# Altium project ESP32_IoT Gateaway.PrjPcb (part 1 of 2)
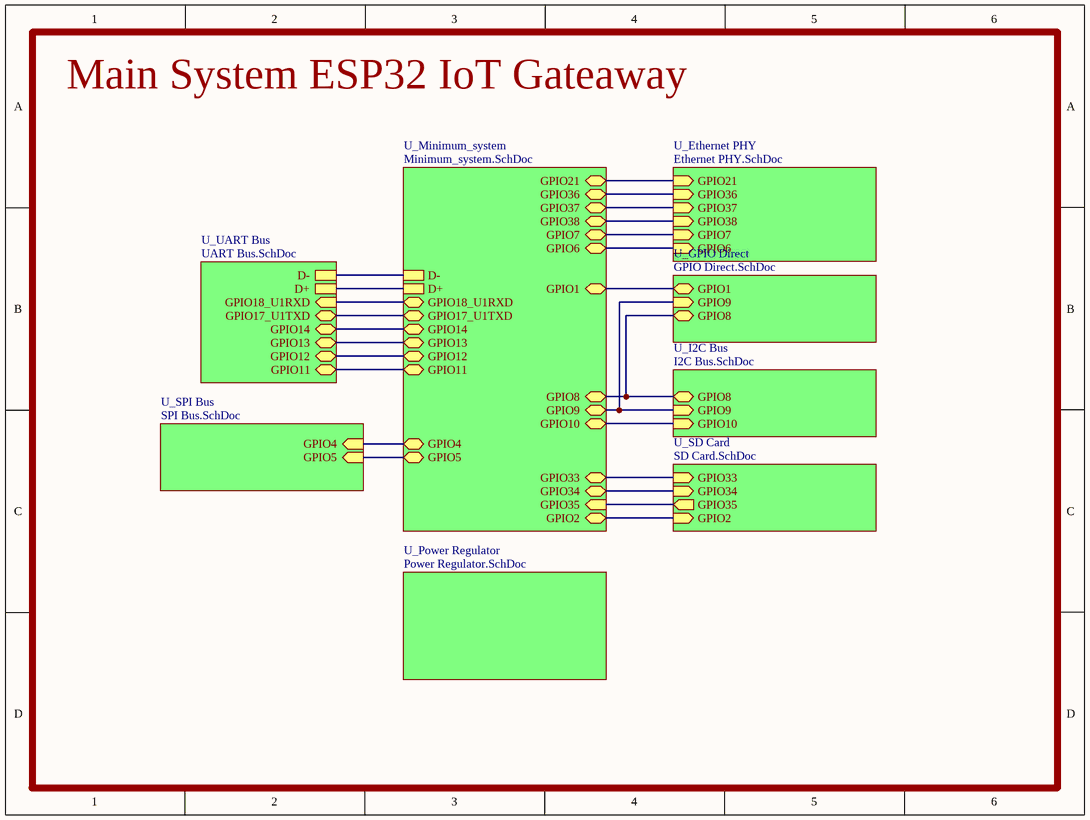
[diagram p0: Main ESP32_IoT Gateaway.SchDoc]
9 sheets, 167 parts. Net scope: hierarchical (ports join the sheet entries above them; power ports are global).
Board file: Main ESP32_IoT Gateaway.PcbDoc
Sheets:
  Main ESP32_IoT Gateaway.SchDoc
    U_UART Bus = UART Bus.SchDoc
    U_Minimum_system = Minimum_system.SchDoc
    U_SPI Bus = SPI Bus.SchDoc
    U_Ethernet PHY = Ethernet PHY.SchDoc
    U_Power Regulator = Power Regulator.SchDoc
    U_SD Card = SD Card.SchDoc
    U_I2C Bus = I2C Bus.SchDoc
    U_GPIO Direct = GPIO Direct.SchDoc

## Sheet Main ESP32_IoT Gateaway.SchDoc
size 203 x 152 mm

### Sub-sheets
U_Ethernet PHY = Ethernet PHY.SchDoc: GPIO21 (in), GPIO36 (in), GPIO37 (in), GPIO38 (in), GPIO6 (in), GPIO7 (in)
U_GPIO Direct = GPIO Direct.SchDoc: GPIO1 (bidir), GPIO9 (in), GPIO8 (bidir)
U_I2C Bus = I2C Bus.SchDoc: GPIO10 (in), GPIO9 (in), GPIO8 (bidir)
U_Minimum_system = Minimum_system.SchDoc: GPIO14 (bidir), GPIO13 (bidir), GPIO12 (bidir), GPIO11 (bidir), D-, D+, GPIO6 (bidir), GPIO7 (bidir), GPIO18_U1RXD (bidir), GPIO17_U1TXD (bidir), GPIO38 (bidir), GPIO37 (bidir), GPIO36 (bidir), GPIO21 (bidir), GPIO1 (bidir), GPIO5 (bidir), GPIO4 (bidir), GPIO2 (bidir), GPIO35 (in), GPIO34 (bidir), GPIO33 (bidir), GPIO10 (bidir), GPIO9 (bidir), GPIO8 (bidir)
U_Power Regulator = Power Regulator.SchDoc: no entries
U_SD Card = SD Card.SchDoc: GPIO33 (in), GPIO34 (in), GPIO35 (out), GPIO2 (in)
U_SPI Bus = SPI Bus.SchDoc: GPIO4 (in), GPIO5 (in)
U_UART Bus = UART Bus.SchDoc: GPIO12 (bidir), GPIO11 (bidir), GPIO13 (bidir), GPIO14 (bidir), GPIO17_U1TXD (bidir), GPIO18_U1RXD (in), D-, D+

### Nets
ADS_ALERT: sheet U_Minimum_system/GPIO10, sheet U_I2C Bus/GPIO10
CD/DATA3: sheet U_Minimum_system/GPIO2, sheet U_SD Card/GPIO2
D_N: sheet U_UART Bus/D-, sheet U_Minimum_system/D-
D_P: sheet U_UART Bus/D+, sheet U_Minimum_system/D+
I2C_SCL: sheet U_Minimum_system/GPIO9, sheet U_I2C Bus/GPIO9, sheet U_GPIO Direct/GPIO9
I2C_SDA: sheet U_Minimum_system/GPIO8, sheet U_I2C Bus/GPIO8, sheet U_GPIO Direct/GPIO8
NetESP32S3_6: sheet U_Minimum_system/GPIO1, sheet U_GPIO Direct/GPIO1
NetESP32S3_9: sheet U_Minimum_system/GPIO4, sheet U_SPI Bus/GPIO4
NetESP32S3_10: sheet U_Minimum_system/GPIO5, sheet U_SPI Bus/GPIO5
NetESP32S3_11: sheet U_Minimum_system/GPIO6, sheet U_Ethernet PHY/GPIO6
NetESP32S3_12: sheet U_Minimum_system/GPIO7, sheet U_Ethernet PHY/GPIO7
NetESP32S3_16: sheet U_UART Bus/GPIO11, sheet U_Minimum_system/GPIO11
NetESP32S3_17: sheet U_UART Bus/GPIO12, sheet U_Minimum_system/GPIO12
NetESP32S3_18: sheet U_UART Bus/GPIO13, sheet U_Minimum_system/GPIO13
NetESP32S3_19: sheet U_UART Bus/GPIO14, sheet U_Minimum_system/GPIO14
NetESP32S3_23: sheet U_UART Bus/GPIO17_U1TXD, sheet U_Minimum_system/GPIO17_U1TXD
NetESP32S3_24: sheet U_UART Bus/GPIO18_U1RXD, sheet U_Minimum_system/GPIO18_U1RXD
NetESP32S3_27: sheet U_Minimum_system/GPIO21, sheet U_Ethernet PHY/GPIO21
NetESP32S3_38: sheet U_Minimum_system/GPIO33, sheet U_SD Card/GPIO33
NetESP32S3_39: sheet U_Minimum_system/GPIO34, sheet U_SD Card/GPIO34
NetESP32S3_40: sheet U_Minimum_system/GPIO35, sheet U_SD Card/GPIO35
NetESP32S3_41: sheet U_Minimum_system/GPIO36, sheet U_Ethernet PHY/GPIO36
NetESP32S3_42: sheet U_Minimum_system/GPIO37, sheet U_Ethernet PHY/GPIO37
NetESP32S3_43: sheet U_Minimum_system/GPIO38, sheet U_Ethernet PHY/GPIO38

### Notes on the sheet
- Main System ESP32 IoT Gateaway

## Sheet UART Bus.SchDoc
size A
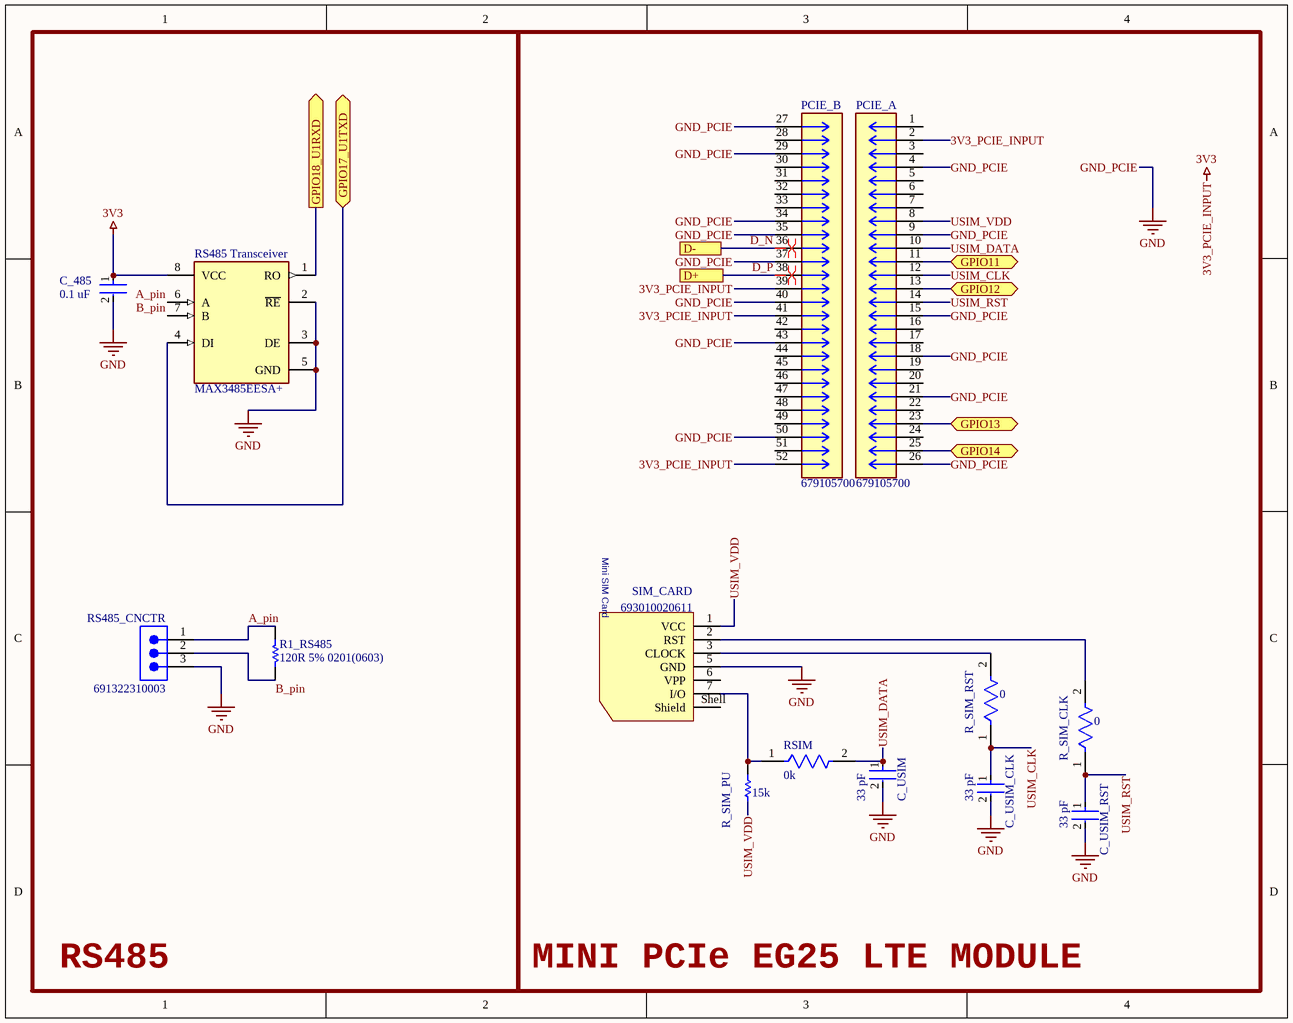
[diagram p1: UART Bus.SchDoc]

### Parts
C_485  0.1 uF  [FP-GRM155-0_05-MFG]
C_USIM  33 pF  [FP-GCM155-0_05-IPC_A]
C_USIM_CLK  33 pF  [FP-GCM155-0_05-IPC_A]
C_USIM_RST  33 pF  [FP-GCM155-0_05-IPC_A]
PCIE_  679105700  [CONN_679105700_MOL]  (parts A,B of 2)
R1_RS485  120R 5% 0201(0603)  [RESC0201(0603)_M]
R_SIM_CLK  0  [FP-CRG0402-IPC_C]
R_SIM_PU  15k  [RESC3116X65X40NL10T20]
R_SIM_RST  0  [FP-CRG0402-IPC_C]
RS485_CNCTR  691322310003  [691322310003]
RS485_Transceiver  MAX3485EESA+  [FP-S8-5-MFG]
RSIM  0k  [FP-CRG0402-IPC_C]
SIM_CARD  693010020611  [693010020611]

### Blocks framed on the sheet
RS485: C_485 R1_RS485 RS485_CNCTR RS485_Transceiver
MINI PCIe EG25 LTE MODULE: C_USIM C_USIM_CLK C_USIM_RST PCIE_ R_SIM_CLK R_SIM_PU R_SIM_RST RSIM SIM_CARD

### Ports
D+, D-, GPIO11 (bidir), GPIO12 (bidir), GPIO13 (bidir), GPIO14 (bidir), GPIO17_U1TXD (bidir), GPIO18_U1RXD (out)

### Nets
3V3: C_485.1 PCIE_.2 PCIE_.39 PCIE_.41 PCIE_.52 RS485_Transceiver.8(VCC)  [also labelled 3V3_PCIE_INPUT]
GND: C_485.2 C_USIM.2 C_USIM_CLK.2 C_USIM_RST.2 PCIE_.4 PCIE_.9 PCIE_.15 PCIE_.18 PCIE_.21 PCIE_.26 PCIE_.27 PCIE_.29 PCIE_.34 PCIE_.35 PCIE_.37 PCIE_.40 PCIE_.43 PCIE_.50 RS485_CNCTR.3 RS485_Transceiver.2(~{RE}) RS485_Transceiver.3(DE) RS485_Transceiver.5(GND) SIM_CARD.5(GND)  [also labelled GND_PCIE]
A_pin: R1_RS485.1 RS485_CNCTR.1 RS485_Transceiver.6(A)
B_pin: R1_RS485.2 RS485_CNCTR.2 RS485_Transceiver.7(B)
D_N: PCIE_.36 ; port D-
D_P: PCIE_.38 ; port D+
USIM_CLK: C_USIM_CLK.1 PCIE_.12 R_SIM_RST.1
USIM_DATA: C_USIM.1 PCIE_.10 RSIM.2
USIM_RST: C_USIM_RST.1 PCIE_.14 R_SIM_CLK.1
USIM_VDD: PCIE_.8 R_SIM_PU.2 SIM_CARD.1(VCC)
NetESP32S3_16: PCIE_.11 ; port GPIO11
NetESP32S3_17: PCIE_.13 ; port GPIO12
NetESP32S3_18: PCIE_.23 ; port GPIO13
NetESP32S3_19: PCIE_.25 ; port GPIO14
NetESP32S3_23: RS485_Transceiver.4(DI) ; port GPIO17_U1TXD
NetESP32S3_24: RS485_Transceiver.1(RO) ; port GPIO18_U1RXD
NetR_SIM_CLK_2: R_SIM_CLK.2 SIM_CARD.2(RST)
NetR_SIM_PU_1: R_SIM_PU.1 RSIM.1 SIM_CARD.7(I/O)
NetR_SIM_RST_2: R_SIM_RST.2 SIM_CARD.3(CLOCK)

Not connected (* = marked no-connect by the designer): PCIE_ 1 3 5 6 7 16 17 19 20 22 24 28 30 31 32 33 42 44 45 46 47 48 49 51; SIM_CARD 6(VPP) Shell(Shield)

### Layout directives
differential pair: D_N, D_P

### Notes on the sheet
- (in symbol CMP-1502-00155-3) Mini SIM Card

### Library data of the parts
C_485 = CMP-06035-062118-1: Chip Multilayer Ceramic Capacitors for General Purpose, 0402, 0.10uF, X7R, 15%, 20%, 50V; RoHS Compliant: Yes
C_USIM C_USIM_CLK C_USIM_RST = CMP-2008-03705-2: Ceramic Capacitor for Automotive 33pF ±5% 50VDC C0G 0402 Paper T/R; Voltage Rating: 50V; Tolerance: 5%; Packaging: Tape and Reel; Case/Package: 0402; Package Quantity: 10000; Dielectric: C0G; Voltage Rating (DC): 50V; Case Code (Imperial): 0402; Width: 0.02inch; Length: 1mm; Capacitance: 33pF; Mount: Surface Mount; Case Code (Metric): 1005; Weight: 0.000212oz; Thickness: 0.022inch; Lead Free: Lead Free; Height: 0.5mm; Max Operating Temperature: 125°C; Termination: SMD/SMT; Min Operating Temperature: -55°C; Depth: 0.5mm; Ratings: AEC-Q200
PCIE_ = CMP-018-000000-1: Pin Count: 52; Package: None; Availability: Unavailable; MP: 679105700; Value: *; Source: 679105700.SchLib; Price: None; Design Item ID: 679105700; Component Type: Standard
R1_RS485 = CMP-1010-00052-1: 120R 0.05W 5% 0201 (0603 Metric)  SMD; Case-EIA: 0201; Case-Metric: 0603; Value: 120.00 Ohm; Power: 0.05 W; Tolerance: 5 %; Technology: SMT
R_SIM_CLK R_SIM_RST RSIM = CMP-03211-011400-1: RES SMD 0 OHM JUMPER 1/16W 0402; Number of Resistors: 1; Tolerance: 0%; Voltage Rating: 50V; Insulation Resistance: 1GR; Power Rating: 63mW; Temperature Coefficient: 200ppm/°C; Resistance: 0mR; Weight: 2.3E-05oz; Number of Terminations: 2; Technology: THICK FILM; Resistor Type: Thick Film; Mount: Surface Mount; Termination: Solder; Number of Pins: 2; RoHS Compliant: Yes; Packaging: Tape and Reel; Depth: 0.5mm; Case Code (Metric): 1005; Min Operating Temperature: -55°C; Series: CRG; Height: 0.35mm; Voltage Rating (DC): 50V; Case Code (Imperial): 0402; Max Operating Temperature: 125°C; ELV: Compliant; Case/Package: 0402; Length: 1mm; Radiation Hardening: No; Width: 0.5mm; Package Quantity: 10000
R_SIM_PU = CMP-2003-03512-1: Manufacturer: Yageo; Part Number: RC1206FR-1015KL
RS485_CNCTR = CMP-1502-01887-3: 322; 3.81mm Pitch Straight Pluggable Term Block; PCB Header; Through Hole; 3 Way; Voltage: 300V; Current: 10A; Gender: Male; Number of Contacts: 3; Number of Levels: 1; Lead Pitch: 3.81mm; Termination: Solder; Packaging: Box; Length: 10.5mm; Contact Plating: Tin; RoHS: Compliant; Number of Rows: 1; Contact Material: Tin; Height: 7.2mm; Color: Green; Number of Pins: 3; Max Operating Temperature: 105°C; Current Rating: 10A; Voltage Rating: 300V; Min Operating Temperature: -40°C; Pitch: 3.81mm; Mount: Through Hole; Number of Positions Per Level: 3; Width: 12.82mm
RS485_Transceiver = CMP-05679-000038-1: IC TXRX RS485/422 10MBPS 8SOIC; Manufacturer: Maxim Integrated; Number Of Receivers: 1; Simplex Duplex: Half Duplex; Data Rate: 15Mbits/s; Interface: RS-485,RS-422; Max Supply Voltage: 3.6V; Nominal Supply Current: 0.95-1.1mA; Min Supply Voltage: 3V; Standoff Height: 0.1mm; Mouser Description: RS-422/RS-485 Interface IC 3.3V 12Mbps Transceiver; Lead Free: Yes; Footprint Url: https://pdfserv.maximintegrated.com/land_patterns/90-0096.PDF; Device Class L1: Integrated Circuits (ICs); Device Class L3: RS-232 / RS-422 / RS-485 Interface ICs; RoHS: TRUE; Height: 1.75mm; ComponentLink2URL: https://datasheets.maximintegrated.com/en/ds/MAX3483E-MAX3491E.pdf; Temperature Range High: +85°C; Temperature: -40°C to +85°C; Manufacturer Part Number: MAX3485EESA+; Number Of Transmitters: 1; Device Class L2: Interface ICs; Octopart: https://octopart.com/max3485eesa%2B-maxim+integrated-39731903; ComponentLink2Description: Datasheet; Category: IC; Digikey Description: IC TXRX RS485/422 10MBPS 8SOIC; Automotive: No; Temperature Range Low: -40°C; Package: S8-5
SIM_CARD = CMP-1502-00155-3: WR-CRD Mini SIM Card Connector Header Shielded; Current Rating: 500mA; Operating Supply Voltage: 50V; Insulation Resistance: 500MΩ; Connector Type: Connector, Socket; Number of Positions: 6; Mount: Surface Mount; Max Operating Temperature: 85°C; Length: 16.4mm; Height: 1.8mm; REACH SVHC: Unknown; Number of Contacts: 6; Min Operating Temperature: -25°C; Number of Pins: 6; Contact Material: Copper; Width: 16.3mm; Contact Plating: Gold; Packaging: Tape and Reel; RoHS: Compliant

## Sheet Minimum_system.SchDoc
size 431 x 279 mm; ENG_APP_DATE: --/--/--; DSN_APP_DATE: --/--/--; CHK_APP_DATE: --/--/--
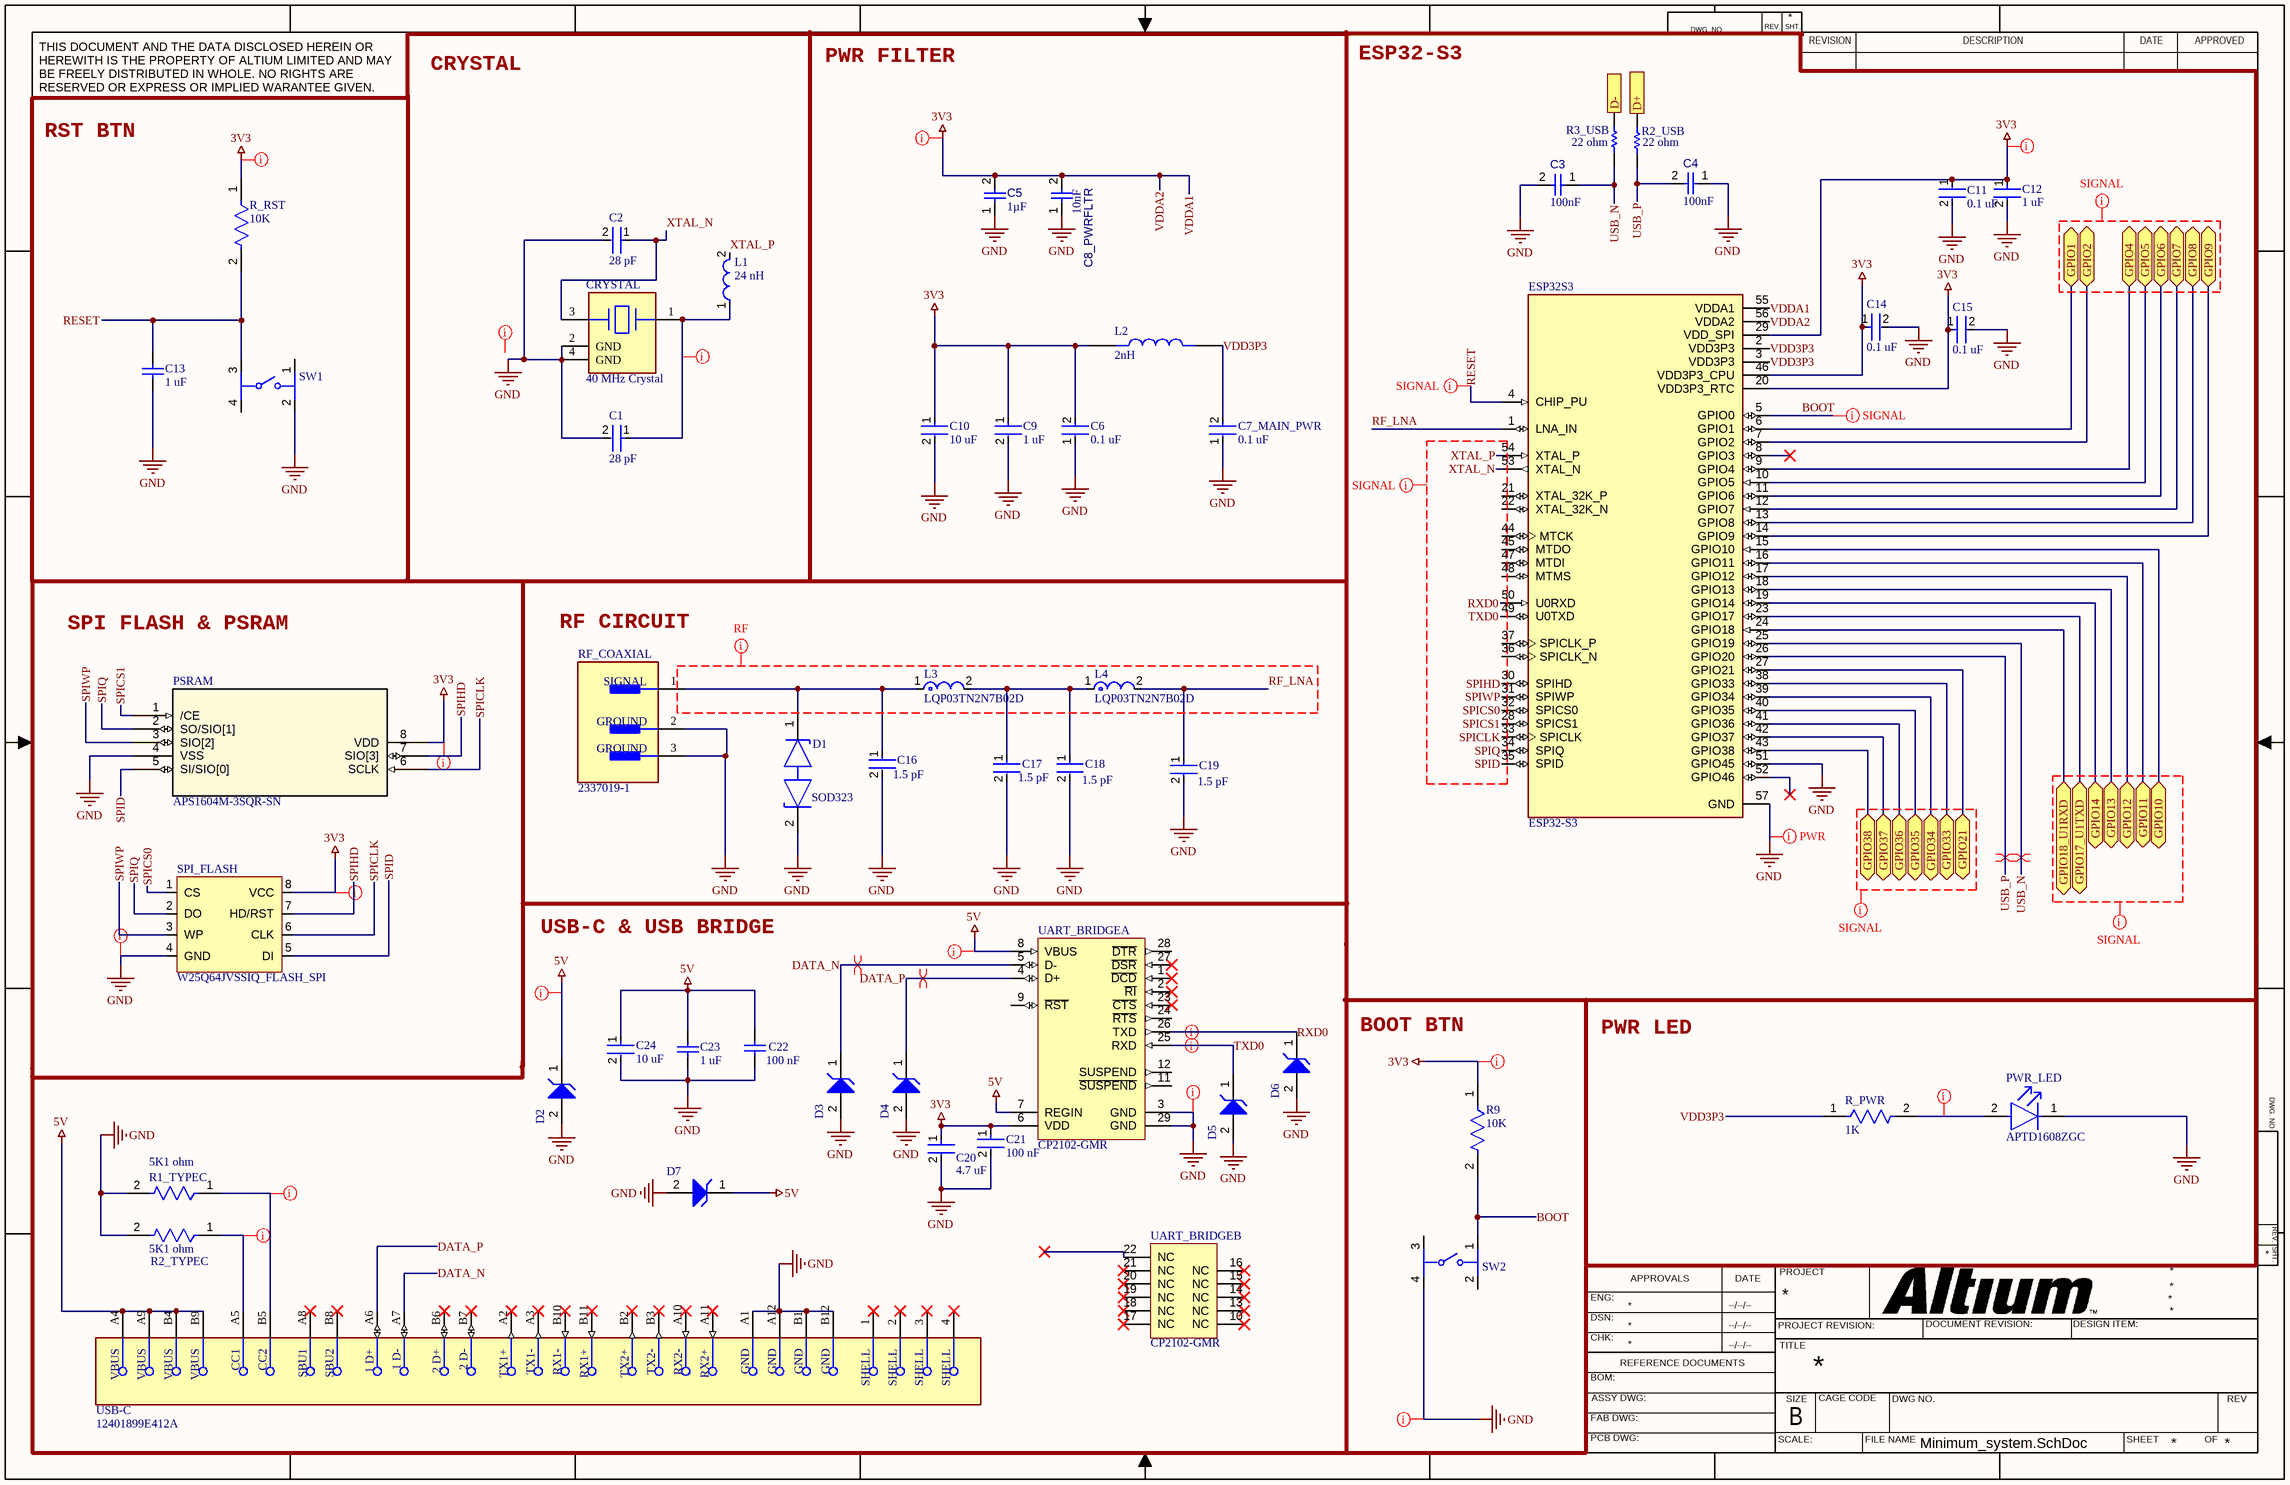
[diagram p2: Minimum_system.SchDoc]

### Parts
C1  28 pF  [FP-GQM219-0_15-MFG]
C2  28 pF  [FP-GQM219-0_15-MFG]
C3  value 100nF  [CAPC0402(1005)60_L]  (hidden comment: Capacitor 100nF +/-20% 50V 0402)
C4  value 100nF  [CAPC0402(1005)60_L]  (hidden comment: Capacitor 100nF +/-20% 50V 0402)
C5  value 1µF  [CAPC1608X90X35ML15T15]  (hidden comment: Capacitor 1uF +/- 10% 16V 0603)
C6  0.1 uF  [FP-C1608-080-0_1-IPC_B]
C7_MAIN_PWR  0.1 uF  [FP-C1608-080-0_1-IPC_B]
C8_PWRFLTR  value 10nF  [CAPC0402(1005)60_L]  (hidden comment: Capacitor 10nF +/-20% 50V 0402)
C9  1 uF  [FP-GRM21B-0_2-e0_2_0_7-MFG]
C10  10 uF  [FP-GRM188-0_15-IPC_C]
C11  0.1 uF  [FP-C1608-080-0_1-IPC_B]
C12  1 uF  [FP-GRM21B-0_2-e0_2_0_7-MFG]
C13  1 uF  [CAPC2013X140X50NL20T25]
C14  0.1 uF  [FP-CC0201-BA-MFG]
C15  0.1 uF  [FP-CC0201-BA-MFG]
C16  1.5 pF  [FP-GRM033-0_03-MFG]
C17  1.5 pF  [FP-GRM033-0_03-MFG]
C18  1.5 pF  [FP-GRM033-0_03-MFG]
C19  1.5 pF  [FP-GRM033-0_03-MFG]
C20  4.7 uF  [FP-GCJ31C-0_3-IPC_C]
C21  100 nF  [FP-GRM155-0_05-MFG]
C22  100 nF  [CAPC0603X33X15NL03T05]
C23  1 uF  [CAPC2013X140X50NL20T25]
C24  10 uF  [FP-GRM188-0_15-IPC_C]
CRYSTAL  40 MHz Crystal  [FP-ABM8AIG-MFG]
D1  SOD323  [FP-SOD323-CA-MFG]
D2  824520581  [WE-TVSP_DO-214AA_Unidirectional]  (value not drawn)
D3  824520581  [WE-TVSP_DO-214AA_Unidirectional]  (value not drawn)
D4  824520581  [WE-TVSP_DO-214AA_Unidirectional]  (value not drawn)
D5  824520581  [WE-TVSP_DO-214AA_Unidirectional]  (value not drawn)
D6  824520581  [WE-TVSP_DO-214AA_Unidirectional]  (value not drawn)
D7  824520581  [WE-TVSP_DO-214AA_Unidirectional]  (value not drawn)
ESP32S3  ESP32-S3  [IC_ESP32-S3]
L1  24 nH  [FP-LQW15AN_00-W0_5-0_1-MFG]
L2  value 2nH  [INDC0603X28N]  (hidden comment: ATFC-0201HQ-2N0B-T)
L3  LQP03TN2N7B02D  [FP-LQP03TG_02-IPC_A]
L4  LQP03TN2N7B02D  [FP-LQP03TG_02-IPC_A]
PSRAM  APS1604M-3SQR-SN  [SOP8L_APS1604M-3SQR-SN_APY]
PWR_LED  APTD1608ZGC  [FP-APTD1608ZGC-MFG]
R1_TYPEC  5K1 ohm  [FP-CRCW1206-e3-IPC_B]
R2_TYPEC  5K1 ohm  [FP-CRCW1206-e3-IPC_B]
R2_USB  22 ohm  [RESC1608X55X25LL10T15]
R3_USB  22 ohm  [RESC1608X55X25LL10T15]
R9  10K  [FP-AC0603-IPC_A]
R_PWR  1K  [FP-RP732B-MFG]
R_RST  10K  [FP-AC0603-IPC_A]
RF_COAXIAL  2337019-1  [FP-2337019-1-MFG]
SPI_FLASH  W25Q64JVSSIQ_FLASH_SPI  [SOIC127P790X216-8N]
SW1  PTS810SJM250SMTRLFS  [FP-PTS810SJM250SMTRLFS-MFG]  (value not drawn)
SW2  PTS810SJM250SMTRLFS  [FP-PTS810SJM250SMTRLFS-MFG]  (value not drawn)
UART_BRIDGE  CP2102-GMR  [SLAB-QFN-28-3125x3125TP_M]  (parts A,B of 2)
USB-C  12401899E412A  [FP-12401899E412A-MFG]

### Ports
D+, D-, GPIO1 (bidir), GPIO2 (bidir), GPIO4 (bidir), GPIO5 (bidir), GPIO6 (bidir), GPIO7 (bidir), GPIO8 (bidir), GPIO9 (bidir), GPIO10 (bidir), GPIO11 (bidir), GPIO12 (bidir), GPIO13 (bidir), GPIO14 (bidir), GPIO17_U1TXD (bidir), GPIO18_U1RXD (bidir), GPIO21 (bidir), GPIO33 (bidir), GPIO34 (bidir), GPIO35 (bidir), GPIO36 (bidir), GPIO37 (bidir), GPIO38 (bidir)

### Nets
3V3: C5.2 C6.2 C8_PWRFLTR.2 C9.1 C10.1 C11.1 C12.1 C14.1 C15.1 C20.1 C21.1 ESP32S3.20(VDD3P3_RTC) ESP32S3.29(VDD_SPI) ESP32S3.46(VDD3P3_CPU) ESP32S3.55(VDDA1) ESP32S3.56(VDDA2) L2.1 PSRAM.8(VDD) R9.1 R_RST.1 SPI_FLASH.8(VCC) UART_BRIDGE.6(VDD)  [also labelled VDDA1, VDDA2]
5V: C22.2 C23.1 C24.1 D2.1(K) D7.1(K) UART_BRIDGE.7(REGIN) UART_BRIDGE.8(VBUS) USB-C.A4(VBUS) USB-C.A9(VBUS) USB-C.B4(VBUS) USB-C.B9(VBUS)
GND: C1.2 C2.2 C3.2 C4.1 C5.1 C6.1 C7_MAIN_PWR.1 C8_PWRFLTR.1 C9.2 C10.2 C11.2 C12.2 C13.2 C14.2 C15.2 C16.2 C17.2 C18.2 C19.2 C20.2 C21.2 C22.1 C23.2 C24.2 CRYSTAL.2(GND) CRYSTAL.4(GND) D1.2(K2) D2.2(A) D3.2(A) D4.2(A) D5.2(A) D6.2(A) D7.2(A) ESP32S3.51(GPIO45) ESP32S3.57(GND) PSRAM.4(VSS) PWR_LED.1(C) R1_TYPEC.2 R2_TYPEC.2 RF_COAXIAL.2(GROUND) RF_COAXIAL.3(GROUND) SPI_FLASH.4(GND) SW1.2 SW2.4 UART_BRIDGE.3(GND) UART_BRIDGE.29(GND) USB-C.A1(GND) USB-C.A12(GND) USB-C.B1(GND) USB-C.B12(GND)
ADS_ALERT: ESP32S3.15(GPIO10) ; port GPIO10
BOOT: ESP32S3.5(GPIO0) R9.2 SW2.1
CD/DATA3: ESP32S3.7(GPIO2) ; port GPIO2
D_N: R3_USB.1 ; port D-
D_P: R2_USB.1 ; port D+
DATA_N: D3.1(K) UART_BRIDGE.5(D-) USB-C.A7(1_D-)
DATA_P: D4.1(K) UART_BRIDGE.4(D+) USB-C.A6(1_D+)
I2C_SCL: ESP32S3.14(GPIO9) ; port GPIO9
I2C_SDA: ESP32S3.13(GPIO8) ; port GPIO8
RESET: C13.1 ESP32S3.4(CHIP_PU) R_RST.2 SW1.3
RF_LNA: C19.1 ESP32S3.1(LNA_IN) L4.2
RXD0: D6.1(K) ESP32S3.50(U0RXD) UART_BRIDGE.26(TXD)
SPICLK: ESP32S3.33(SPICLK) PSRAM.6(SCLK) SPI_FLASH.6(CLK)
SPICS0: ESP32S3.32(SPICS0) SPI_FLASH.1(CS)
SPICS1: ESP32S3.28(SPICS1) PSRAM.1(/CE)
SPID: ESP32S3.35(SPID) PSRAM.5(SI/SIO[0]) SPI_FLASH.5(DI)
SPIHD: ESP32S3.30(SPIHD) PSRAM.7(SIO[3]) SPI_FLASH.7(HD/RST)
SPIQ: ESP32S3.34(SPIQ) PSRAM.2(SO/SIO[1]) SPI_FLASH.2(DO)
SPIWP: ESP32S3.31(SPIWP) PSRAM.3(SIO[2]) SPI_FLASH.3(WP)
TXD0: D5.1(K) ESP32S3.49(U0TXD) UART_BRIDGE.25(RXD)
USB_N: C3.1 ESP32S3.25(GPIO19) R3_USB.2
USB_P: C4.2 ESP32S3.26(GPIO20) R2_USB.2
VDD3P3: C7_MAIN_PWR.2 ESP32S3.2(VDD3P3) ESP32S3.3(VDD3P3) L2.2 R_PWR.1
XTAL_N: C2.1 CRYSTAL.3 ESP32S3.53(XTAL_N)
XTAL_P: ESP32S3.54(XTAL_P) L1.2
NetC1_1: C1.1 CRYSTAL.1 L1.1
NetC16_1: C16.1 D1.1(K1) L3.1 RF_COAXIAL.1(SIGNAL)
NetC17_1: C17.1 C18.1 L3.2 L4.1
NetESP32S3_6: ESP32S3.6(GPIO1) ; port GPIO1
NetESP32S3_9: ESP32S3.9(GPIO4) ; port GPIO4
NetESP32S3_10: ESP32S3.10(GPIO5) ; port GPIO5
NetESP32S3_11: ESP32S3.11(GPIO6) ; port GPIO6
NetESP32S3_12: ESP32S3.12(GPIO7) ; port GPIO7
NetESP32S3_16: ESP32S3.16(GPIO11) ; port GPIO11
NetESP32S3_17: ESP32S3.17(GPIO12) ; port GPIO12
NetESP32S3_18: ESP32S3.18(GPIO13) ; port GPIO13
NetESP32S3_19: ESP32S3.19(GPIO14) ; port GPIO14
NetESP32S3_23: ESP32S3.23(GPIO17) ; port GPIO17_U1TXD
NetESP32S3_24: ESP32S3.24(GPIO18) ; port GPIO18_U1RXD
NetESP32S3_27: ESP32S3.27(GPIO21) ; port GPIO21
NetESP32S3_38: ESP32S3.38(GPIO33) ; port GPIO33
NetESP32S3_39: ESP32S3.39(GPIO34) ; port GPIO34
NetESP32S3_40: ESP32S3.40(GPIO35) ; port GPIO35
NetESP32S3_41: ESP32S3.41(GPIO36) ; port GPIO36
NetESP32S3_42: ESP32S3.42(GPIO37) ; port GPIO37
NetESP32S3_43: ESP32S3.43(GPIO38) ; port GPIO38
NetPWR_LED_2: PWR_LED.2(A) R_PWR.2
NetR1_TYPEC_1: R1_TYPEC.1 USB-C.B5(CC2)
NetR2_TYPEC_1: R2_TYPEC.1 USB-C.A5(CC1)

Not connected (* = marked no-connect by the designer): ESP32S3 8(GPIO3)* 21(XTAL_32K_P) 22(XTAL_32K_N) 36(SPICLK_N) 37(SPICLK_P) 44(MTCK) 45(MTDO) 47(MTDI) 48(MTMS) 52(GPIO46)*; SW1 1 4; SW2 2 3; UART_BRIDGE 1(~{DCD})* 2(~{RI})* 9(~{RST}) 10(NC)* 11(~{SUSPEND}) 12(SUSPEND) 13(NC)* 14(NC)* 15(NC)* 16(NC)* 17(NC)* 18(NC)* 19(NC)* 20(NC)* 21(NC)* 22(NC)* 23(~{CTS})* 24(~{RTS}) 27(~{DSR})* 28(~{DTR}); USB-C 1(SHELL)* 2(SHELL)* 3(SHELL)* 4(SHELL)* A2(TX1+)* A3(TX1-)* A8(SBU1)* A10(RX2-)* A11(RX2+)* B2(TX2+)* B3(TX2-)* B6(2_D+)* B7(2_D-)* B8(SBU2)* B10(RX1-)* B11(RX1+)*

### Layout directives
differential pair: DATA_N, DATA_P, USB_N, USB_P
net class SIGNAL: (no net found under the mark), BOOT, RXD0, SPICLK, SPICS0, SPICS1, SPID, SPIHD, SPIQ, SPIWP, TXD0, XTAL_N, XTAL_P
net class POWER: 3V3, 5V, (no net found under the mark), GND, NetC1_1, NetPWR_LED_2, NetR1_TYPEC_1, NetR2_TYPEC_1
mark named SIGNAL: RESET
net class RF: RF_LNA

### Notes on the sheet
- CRYSTAL
- PWR FILTER
- ESP32-S3
- RST BTN
- SPI FLASH & PSRAM
- RF CIRCUIT
- USB-C & USB BRIDGE
- BOOT BTN
- PWR LED
- Labels drawn without touching a wire or pin: \
- DWG. NO.
- REV.
- SHT.
- THIS DOCUMENT AND THE DATA DISCLOSED HEREIN OR HEREWITH IS THE PROPERTY OF ALTIUM LIMITED AND MAY BE FREELY DISTRIBUTED IN WHOLE. NO RIGHTS ARE RESERVED OR EXPRESS OR IMPLIED WARANTEE GIVEN.
- REVISION
- DESCRIPTION
- DATE
- APPROVED
- ENG:
- APPROVALS
- PROJECT
- DSN:
- CHK:
- REFERENCE DOCUMENTS
- PROJECT REVISION:
- TITLE
- DOCUMENT REVISION:
- DESIGN ITEM:
- BOM:
- FAB DWG:
- PCB DWG:
- ASSY DWG:
- SCALE:
- SIZE
- B
- CAGE CODE
- FILE NAME
- DWG NO.
- SHEET
- OF
- REV

### Library data of the parts
C1 C2 = CMP-06035-024923-1: Ceramic Capacitor 28pF ±2% 250VDC C0G 0805 Paper T/R
C3 C4 = CMP-001-00067-3: Chip Capacitor, 100nF +/-20%, 50V, 0402, Thickness 0.6 mm; Tolerance: 10%; Min Operating Temperature: -55°C; Pins: 2; Case/Package: 0402; Max Operating Temperature: 85°C; Voltage Rating: 50V; Mounting Technology: SMT
C5 = CMP-001-00004-6: Chip Capacitor, 1 uF, +/- 10%, 16 V, 0603 (1608 Metric); Capacitor Type: Ceramic; Mounting Technology: SM; RoHS Compliant: True; Min Operating Temperature: -55°C; Case/Package: 0603; Pins: 2; Voltage Rating: 16V; Max Operating Temperature: 125°C; Tolerance: 10%
C6 C7_MAIN_PWR C11 = CMP-2000-04982-2: Multilayer Ceramic Capacitors 100nF ±10% 50V X7R SMD 0603; REACH SVHC: No SVHC; Voltage: 50V; Min Operating Temperature: -55°C; Package Quantity: 1; Case Code (Metric): 1608; Series: C; Termination: SMD/SMT; Length: 1.6mm; Voltage Rating: 50V; Case Code (Imperial): 0603; Number of Pins: 2; RoHS Compliant: Yes; Thickness: 0.037inch; Resistor Type: Ceramic; Radiation Hardening: No; Weight: 7.1E-05oz; Mount: Surface Mount; Capacitance: 100nF; Voltage Rating (DC): 50V; Construction: Flat; Tolerance: 10%; Lead Free: Lead Free; Case/Package: 0603; Max Operating Temperature: 125°C; Height: 0.8mm; Depth: 0.8mm; Packaging: Tape and Reel; Width: 0.031inch; Dielectric Material: Ceramic; Dielectric: X7R
C8_PWRFLTR = CMP-001-00069-3: Chip Capacitor, 10nF +/-20%, 50V, 0402, Thickness 0.6 mm; Tolerance: 5%; Max Operating Temperature: 85°C; Pins: 2; Case/Package: 0402; Voltage Rating: 50V; Min Operating Temperature: -55°C; Mounting Technology: SMT
C9 C12 = CMP-06035-022504-1: Chip Multilayer Ceramic Capacitors for General Purpose, 0805, 1.0uF, X7S, 22%, 10%, 100V; Capacitance: 1uF; Width: 1.25mm; Dielectric: X7S; Length: 2mm; Thickness: 1.25mm; Voltage Rating (DC): 100V; Tolerance: 10%
C10 C24 = CMP-06035-033844-1: Chip Multilayer Ceramic Capacitors for General Purpose, 0603, 10uF, X5R, 15%, 20%, 10V; Dielectric: X5R; Thickness: 800um; Tolerance: 20%; Length: 1.6mm; Voltage Rating (DC): 10V; Width: 800um; Capacitance: 10uF
C13 C23 = CMP-2007-04663-1: Part Number: 0805YD105MAT2A; Manufacturer: AVX Interconnect / Elco
C14 C15 = CMP-03422-000955-1: CC0201 100 nF X5R 20.00% 10 V; Manufacturer: Yageo; Manufacturer Part Number: CC0201MRX5R6BB104; Tolerance: 0.2; Temperature Coefficient: 15%; Capacitance: 100 nF; Voltage Rating: 10 V; Value: 100 nF; Material: Ceramic; Height: 0.33mm; ComponentLink2Description: Datasheet; Device Class L3: Ceramic Capacitors; Lead Free: Yes; Temperature Range Low: -55°C; Temperature Range High: +85°C; Mouser Description: Cap Ceramic 0.1uF 10V X5R 20% SMD 0201 85°C Paper T/R; Automotive: No; Temperature Characteristic: X5R; RoHS: TRUE; Octopart: https://octopart.com/cc0201mrx5r6bb104-yageo-82228190; Ipc Land Pattern Name: CAPC6030X30; ComponentLink2URL: http://www.yageo.com/documents/recent/UPY-GPHC_X5R_4V-to-50V_25.pdf; Temperature: -55°C to +85°C; Category: Cap; Package: CC0201-BA; Device Class L2: Capacitors; Footprint Url: http://www.yageo.com/exep/pages/download/literatures/UPY-C_GEN_24.pdf; Device Class L1: Passive Components
C16-C19 = CMP-2010-01517-2: Chip Multilayer Ceramic Capacitors for General Purpose, 0201, 1.5pF, C0G, 30ppm/°C, 0.1pF, 50V; Case Code (Imperial): 0201; Width: 0.012inch; Case Code (Metric): 0603; Length: 0.024inch; Termination: SMD/SMT; Mount: Surface Mount; Min Operating Temperature: -55°C; Case/Package: 0201; Package Quantity: 15000; Thickness: 0.013inch; Packaging: Tape and Reel; Capacitance: 1.5pF; Max Operating Temperature: 125°C; Voltage Rating: 50V; Voltage Rating (DC): 50V
C20 = CMP-06035-027821-1: Cap Ceramic 4.7uF 16V X7R 10% Pad SMD 1206 Soft Termination  +125°C Automotive T/R
C21 = CMP-06035-062118-1: as C_485 on sheet UART Bus; RoHS Compliant: Yes
C22 = CMP-1033-00660-2: Part Number: 02016D104KAT4A; Manufacturer: AVX Interconnect / Elco
CRYSTAL = CMP-27762-015630-1: Crystal 40MHz ±20ppm (Tol) ±100ppm (Stability) 12pF FUND 35Ω Automotive 4-Pin Ultra Mini-CSMD T/R; ESR (Equivalent Series Resistance): 35R; Packaging: Tape and Reel; Height: 0.031inch; Min Operating Temperature: -40°C; Length: 0.126inch; Width: 0.098inch; Frequency: 40MHz; Series: ABM8AIG; Ratings: AEC-Q200; RoHS Compliant: Yes; Frequency Stability: 100ppm; Max Operating Temperature: 125°C; Case/Package: SMD/SMT; Load Capacitance: 12pF; Frequency Tolerance: 20ppm; Mount: Surface Mount
D1 = CMP-14432-000001-1: TVS DIODE 5V 14V SOD323
D2-D7 = CMP-03913-71101600-2: TVS diode [Würth Elektronik] 824520581 TVS diode; Power Line Protection: No; Max Breakdown Voltage: 67.8V; Peak Pulse Power: 600W; Peak Pulse Current: 6.5A; Leakage Current: 1µA; Number of Unidirectional Channels: 1; Clamping Voltage: 93.6V; Polarity: Unidirectional; Reverse Standoff Voltage: 58V; Packaging: Cut Tape; Composition: Zener; Mount: Surface Mount; REACH SVHC: Unknown; RoHS: Compliant; Height: 2.4mm; Length: 4.32mm; Max Operating Temperature: 150°C; Min Operating Temperature: -65°C; Number of Pins: 2; Width: 3.62mm; Min Breakdown Voltage: 67.8V
ESP32S3 = CMP-031-00006-2: IC RF TxRx + MCU Bluetooth, WiFi 802.11b/g/n, Bluetooth v5.0 2.412GHz ~ 2.484GHz 56-VFQFN Exposed Pad; MF: Espressif Systems; Purchase-URL: https://pricing.snapeda.com/search/part/ESP32-S3/?ref=eda; Value: *; SnapEDA_Link: https://www.snapeda.com/parts/ESP32-S3/Espressif+Systems/view-part/?ref=snap; Component Type: Standard; Case/Package: None; Design Item ID: ESP32-S3; Availability: In Stock; Pins: 57; MP: ESP32-S3; Source: ESP32-S3.SchLib; Check_prices: https://www.snapeda.com/parts/ESP32-S3/Espressif+Systems/view-part/?ref=eda; Price: None
L1 = CMP-06042-007532-1: Wire Wound RF Inductor 24nH ±2% 280mA 0.52Ω 0402 (1005); Q Factor: 25; Core Material: Air; Test Frequency: 100MHz; Current: 270mA; Self Resonant Frequency: 3.5GHz; Shielding: Unshielded; DC Resistance (DCR): 520mR; Height: 0.5mm; Lead Free: Lead Free; Max DC Current: 280mA; Width: 0.02inch; Number of Pins: 2; Inductance Tolerance: 2%; Military Standard: Not; REACH SVHC: No SVHC; Case Code (Imperial): 0402; Inductance: 24nH; Case/Package: 0402; Current Rating: 280mA; Min Operating Temperature: -55°C; Case Code (Metric): 1005; Length: 1mm; Mount: Surface Mount; DC Current: 280mA; Weight: 2.8E-05oz; Package Quantity: 10000; Termination: SMD/SMT; Packaging: Tape and Reel; Max Operating Temperature: 125°C; Depth: 0.6mm; Tolerance: 2%
L2 = CMP-006-00023-1: MF: {'manufacturer': u'Abracon LLC'}; MP: ATFC-0201HQ-2N0B-T; Design Item ID: ATFC-0201HQ-2N0B-T; Availability: Unavailable; Component Type: Standard; Case/Package: None; Price: None; Source: ATFC-0201HQ-2N0B-T.SchLib; Pins: 2
L3 L4 = CMP-06042-013213-1: Film type RF Inductor 2.7nH ±0.1nH 500mA 0.2Ω 0201 (0603); Core Material: Non-Magnetic; Tolerance: 3%; Self Resonant Frequency: 6GHz; Current: 350mA; Test Frequency: 500MHz; Q Factor: 14; DC Resistance (DCR): 200mR; Shielding: Unshielded; DC Current: 500mA; Resistor Type: Thin Film; Case/Package: 0201; Max DC Current: 500mA; Length: 0.024inch; Case Code (Imperial): 0201; Min Operating Temperature: -55°C; Width: 0.3mm; Termination: SMD/SMT; Inductance: 2.7nH; REACH SVHC: No SVHC; Max Operating Temperature: 125°C; Height: 0.3mm; Height - Seated (Max): 0.013inch; Military Standard: Not; Packaging: Tape and Reel; Radiation Hardening: No; Lead Free: Lead Free; Package Quantity: 15000; Case Code (Metric): 0603; Current Rating: 500mA; Mount: Surface Mount; Depth: 0.33mm
PSRAM = CMP-014-000000-2: 2 MB PSRAM SPI; Manufacturer_Name: AP Memory; Pin Count: 8; RefDes: RefDes; Type: Type; Manufacturer_Part_Number: APS1604M-3SQR-SN; Copyright: Copyright (C) 2026 Ultra Librarian. All rights reserved.; Source: APS1604M-3SQR-SN.SchLib; Design Item ID: APS1604M-3SQR-SN; Component Type: Standard
PWR_LED = CMP-44529-000047-1: LED GREEN CLEAR CHIP SMD; Forward Current: 20mA; Viewing Angle: 60°; Dominant Wavelength: 525nm; Luminous Intensity: 780mcd; Forward Voltage: 3.3V; Lens Style: Clear; Max Operating Temperature: 85°C; Case/Package: 0603; Illumination Color: Green; Mount: Surface Mount; Case Code (Imperial): 0603; Case Code (Metric): 1608; Min Operating Temperature: -40°C; Length: 1.6mm; Color: Green; Lead Free: Lead Free; Width: 0.8mm; Package Quantity: 2000; Height: 0.95mm; Packaging: Tape and Reel; Test Current: 20mA
R1_TYPEC R2_TYPEC = CMP-1014-00091-2: RES Thick Film, 5.1kΩ, 5%, 0.25W, 200ppm/°C, 1206; Max Power Dissipation: 250mW; Resistance: 5.1kR; Packaging: Tape and Reel; Length: 0.126inch; Case/Package: 1206; Lead Free: Lead Free; Tolerance: 5%; Composition: Thick Film; Min Operating Temperature: -55°C; Height: 0.024inch; Temperature Coefficient: 200ppm/°C; Features: Automotive AEC-Q200; Width: 0.063inch; Number of Terminations: 2; Max Operating Temperature: 155°C; Package Quantity: 20000
R2_USB R3_USB = CMP-2000-04180-1: Manufacturer: Yageo; Part Number: RC0603FR-1022RL
R9 R_RST = CMP-03412-040683-1: RES 10kΩ 5.00% 0.2W 0603
R_PWR = CMP-03211-010976-1: Res Thin Film 1206 1.0KΩ 0.1% 0.25W 15ppm/°C Molded SMD; Manufacturer: TE Connectivity; Manufacturer Part Number: RP73D2B1K0BTDF; Voltage Rating: 200V; Lead Free: Yes; RoHS: TRUE; Category: Res; Tolerance: 0.1%; Octopart: https://octopart.com/rp73d2b1k0btdf-te+connectivity-22741139; packaging: 1000 Reel; Device Class L2: Resistors; Power Rating: 0.25W; Value: 1.0KΩ; Device Class L1: Passive Components; Device Class L3: Chip SMD Resistors; Temperature Range Low: -55°C; Package: RP732B; Series: RP73; Height: 0.65mm; Composition: Thin Film; Temperature Range High: 155°C; Automotive: No; Temperature Coefficient: 15ppm/°C; octopart_url: https://octopart.com/rp73d2b1k0btdf-te+connectivity-22741139; Temperature: -55°C to 155°C; Ipc Land Pattern Name: RESC305155X55; ComponentLink2Description: Datasheet; Resistance: 1.0KΩ; ComponentLink2URL: https://www.te.com/commerce/DocumentDelivery/DDEController?Action=showdoc&DocId=Data+Sheet%7F1773272%7FL%7Fpdf%7FEnglish%7FENG_DS_1773272_L.pdf%7F8-1879255-6
RF_COAXIAL = CMP-03357-000011-1: UMCC MICRO-COAX RECEPTACLE, GEN
SPI_FLASH = CMP-012-000000-2: 8 MB flash SPI; Component Type: Standard; Pin Count: 8; Design Item ID: Component_1; Source: W25Q64JVSSIQ.SchLib
SW1 SW2 = CMP-10040-000001-2: SWITCH TACTILE SPST-NO 0.05A 16V; Throw Configuration: SPST; Operating Force: 160gf; Actuator Type: Standard; Switch Travel: 0.15mm; Switch Function: Off-Mom; Max Current Rating: 50mA; Mechanical Life: 150000Cycles; Illumination Type: Non-Illuminated; Package Quantity: 2900; Depth: 4.6mm; Mount: Surface Mount; Packaging: Tape and Reel; Length: 3.2mm; RoHS Compliant: Yes; Case/Package: SMD/SMT; Voltage Rating (DC): 16V; Min Operating Temperature: -40°C; Termination: J-Bend; Lead Free: Lead Free; Contact Plating: Silver; Orientation: Straight; Max Operating Temperature: 85°C; Current Rating: 50mA; Color: Black
UART_BRIDGE = CMP-2000-04924-1: Single-Chip USB to URAT Bridge, 3.3 V, -40 to 85 degC, 28-Pin QFN, RoHS, Tape and Reel; Manufacturer: Silicon Labs; Interface Circuit Standard 1: RS-232; Transmitter and Receiver FIFO Counter: No; Supply Current: 26mA; Operating Supply Voltage (Min): 3V; Operating Supply Voltage (Typ): 3.3V; Data Rate: 1000kbps; Operating Supply Voltage (Max): 3.6V; Number of Channels: 1; Package URL: http://www.silabs.com/Support%20Documents/TechnicalDocs/C8051T61x.pdf; Operating Temperature (Max): 85C; Datasheet URL: http://www.mouser.com/ds/2/368/CP2102-9-247052.pdf; Operating Temperature Classification: Industrial; Operating Temperature (Min): -40C; Package Description: 28-Pin Quad-Flat No-Leads Package, Body 5 x 5 mm, Pitch 0.5 mm; Manufacturer URL: http://www.silabs.com/; Rad Hardened: No; Package Reference: QFN-28; Pin Count: 28; Packaging: TapeandReel; Mounting: SurfaceMount; Package Type: QFNEP; Datasheet Version: Rev. 1.6, 12/2013
USB-C = CMP-02355-000006-1: USB TYPE C, RECEPTACLE, TOP MOUN

## Sheet SPI Bus.SchDoc
size 149 x 100 mm
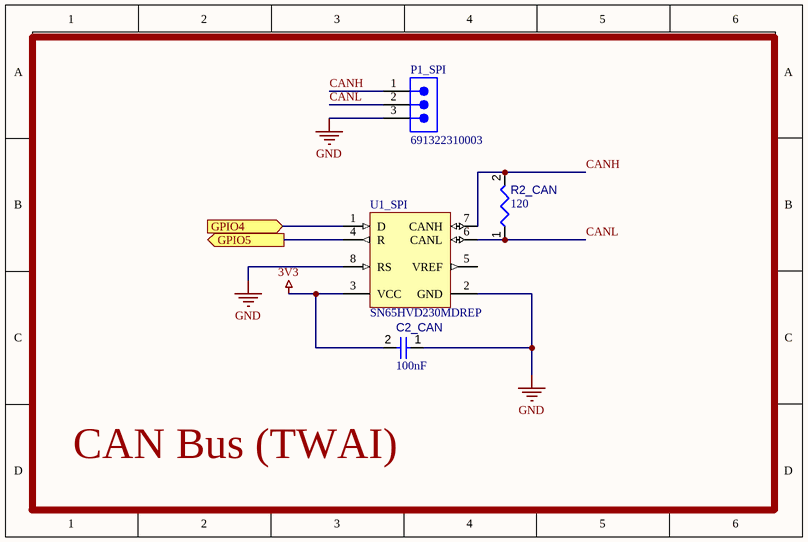
[diagram p3: SPI Bus.SchDoc]

### Parts
C2_CAN  value 100nF  [CAPC0402(1005)60_L]  (hidden comment: Capacitor 100nF +/-20% 50V 0402)
P1_SPI  691322310003  [691322310003]
R2_CAN  value 120  [RESC0603(1608)_L]  (hidden comment: Resistor 120R +/-5 % 0603 0.1 W)
U1_SPI  SN65HVD230MDREP  [D0008A_L]

### Ports
GPIO4 (in), GPIO5 (out)

### Nets
3V3: C2_CAN.2 U1_SPI.3(VCC)
GND: C2_CAN.1 P1_SPI.3 U1_SPI.2(GND) U1_SPI.8(RS)
CANH: P1_SPI.1 R2_CAN.2 U1_SPI.7(CANH)
CANL: P1_SPI.2 R2_CAN.1 U1_SPI.6(CANL)
NetESP32S3_9: U1_SPI.1(D) ; port GPIO4
NetESP32S3_10: U1_SPI.4(R) ; port GPIO5

Not connected (* = marked no-connect by the designer): U1_SPI 5(VREF)

### Notes on the sheet
- CAN Bus (TWAI)

### Library data of the parts
C2_CAN = CMP-001-00067-3: as C3 on sheet Minimum_system; Min Operating Temperature: -55°C; Pins: 2; Case/Package: 0402; Max Operating Temperature: 85°C; Voltage Rating: 50V; Mounting Technology: SMT
P1_SPI = CMP-1502-01887-3: as RS485_CNCTR on sheet UART Bus; Lead Pitch: 3.81mm; Termination: Solder; Packaging: Box; Length: 10.5mm; Contact Plating: Tin; RoHS: Compliant; Number of Rows: 1; Contact Material: Tin; Height: 7.2mm; Color: Green; Number of Pins: 3; Max Operating Temperature: 105°C; Current Rating: 10A; Voltage Rating: 300V; Min Operating Temperature: -40°C; Pitch: 3.81mm; Mount: Through Hole; Number of Positions Per Level: 3; Width: 12.82mm
R2_CAN = CMP-009-00176-3: Chip Resistor, 120 Ohms, +/-5 %, 0.1 W, -55 to 155 degC, 0603; Power: 100mW; Tolerance: 5%; Max Operating Temperature: 155°C; Pins: 2; Case/Package: 0603; Min Operating Temperature: -55°C
U1_SPI = CMP-0315-00052-2: Enhanced Product 3.3 V Can Transceiver with Standby Mode, 17 mA, -55 to 125 degC, 8-pin SOIC (D), Green (RoHS & no Sb/Br); Manufacturer: Texas Instruments; Supply Voltage(s)(V): 3.3; ICC(Max)(mA): 17; Receivers Per Package: 1; Transient Pulse Protection(V): -25 to 25; Rating: HiRel Enhanced Product; DatasheetVersion: SGLS356; Isolated: No; PackageDescription: 8-Pin Plastic Small Outline Integrated Circuit, 4.9 x 3.9 mm, Pitch 1.27 mm Pitch; Mounting Technology: Surface Mount; ComponentLink1Description: Datasheet; Low Power Mode: Standby; PackageVersion: revM, Jun-2011; SubFamily: CAN; ComponentLink1URL: http://www.ti.com/general/docs/lit/getliterature.tsp?genericPartNumber=SN65HVD230M-EP&fileType=pdf; Code_JEDEC: MS-012AA; Drivers Per Package: 1; Footprint: PCA82C250; PackageReference: D0008A; PartNumber: SN65HVD230MDREP; Eco-Plan: Green (RoHS & no Sb/Br)

## Sheet Ethernet PHY.SchDoc
size 317 x 190 mm
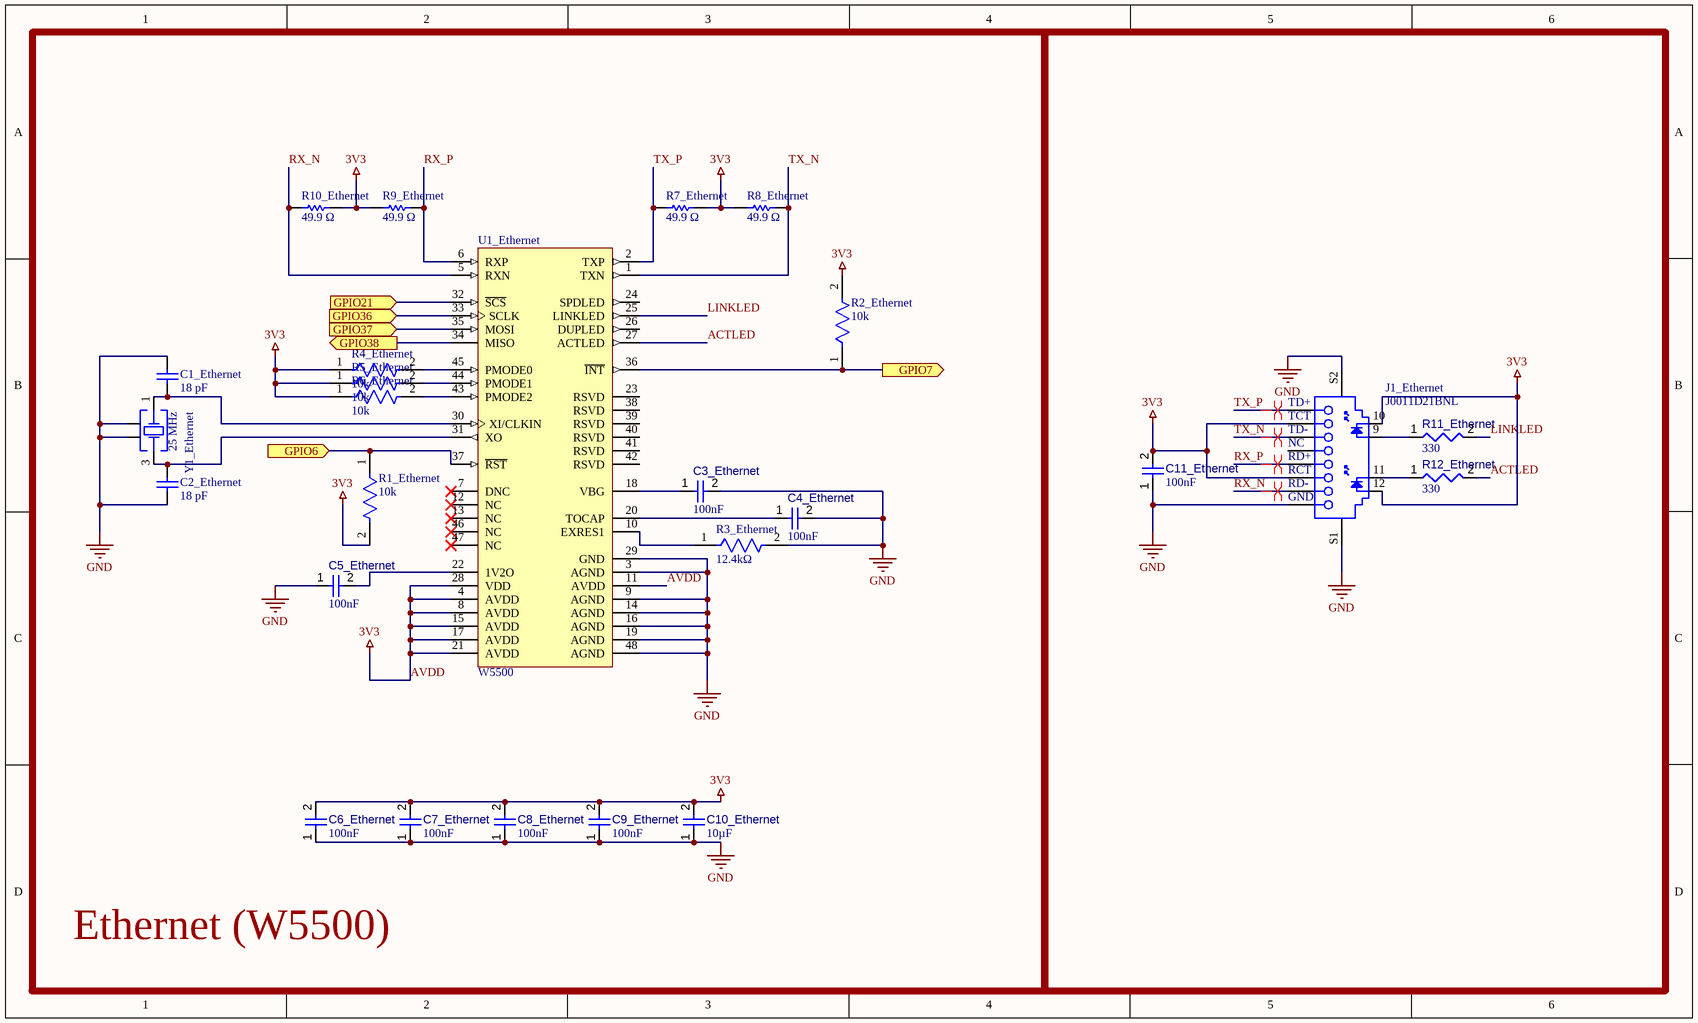
[diagram p4: Ethernet PHY.SchDoc]

### Parts
C1_Ethernet  18 pF  [CAPC1608X90X35LL10T15]
C2_Ethernet  18 pF  [CAPC1608X90X35LL10T15]
C3_Ethernet  value 100nF  [CAPC0402(1005)60_L]  (hidden comment: Capacitor 100nF +/-20% 10V 0402)
C4_Ethernet  value 100nF  [CAPC0402(1005)60_L]  (hidden comment: Capacitor 100nF +/-20% 10V 0402)
C5_Ethernet  value 100nF  [CAPC0402(1005)60_L]  (hidden comment: Capacitor 100nF +/-20% 10V 0402)
C6_Ethernet  value 100nF  [CAPC0402(1005)60_L]  (hidden comment: Capacitor 100nF +/-20% 10V 0402)
C7_Ethernet  value 100nF  [CAPC0402(1005)60_L]  (hidden comment: Capacitor 100nF +/-20% 10V 0402)
C8_Ethernet  value 100nF  [CAPC0402(1005)60_L]  (hidden comment: Capacitor 100nF +/-20% 10V 0402)
C9_Ethernet  value 100nF  [CAPC0402(1005)60_L]  (hidden comment: Capacitor 100nF +/-20% 10V 0402)
C10_Ethernet  value 10µF  [CAPC0603(1608)100_L]  (hidden comment: Capacitor 10µF +/-20% 10V 0603)
C11_Ethernet  value 100nF  [CAPC0402(1005)60_L]  (hidden comment: Capacitor 100nF +/-20% 10V 0402)
J1_Ethernet  J0011D21BNL  [PULS-J00XXD21XNL-B-12]
R1_Ethernet  value 10k  [FP-CRGCQ1206-IPC_C]  (hidden comment: CRGCQ1206F10K)
R2_Ethernet  value 10k  [FP-CRGCQ1206-IPC_C]  (hidden comment: CRGCQ1206F10K)
R3_Ethernet  12.4kΩ  [FP-TFCR0805-IPC_C]
R4_Ethernet  value 10k  [FP-CRGCQ1206-IPC_C]  (hidden comment: CRGCQ1206F10K)
R5_Ethernet  value 10k  [FP-CRGCQ1206-IPC_C]  (hidden comment: CRGCQ1206F10K)
R6_Ethernet  value 10k  [FP-CRGCQ1206-IPC_C]  (hidden comment: CRGCQ1206F10K)
R7_Ethernet  49.9 Ω  [RESC1608X55X25NL10T15]
R8_Ethernet  49.9 Ω  [RESC1608X55X25NL10T15]
R9_Ethernet  49.9 Ω  [RESC1608X55X25NL10T15]
R10_Ethernet  49.9 Ω  [RESC1608X55X25NL10T15]
R11_Ethernet  value 330  [RESC0402(1005)_L]  (hidden comment: Resistor 330R +/-5 % 0402 63 mW)
R12_Ethernet  value 330  [RESC0402(1005)_L]  (hidden comment: Resistor 330R +/-5 % 0402 63 mW)
U1_Ethernet  W5500  [WIZ-W5500-LQFP-48_M]
Y1_Ethernet  25 MHz  [WE-XTAL_CFPX-180]

### Blocks framed on the sheet
Ethernet (W5500): C1_Ethernet C2_Ethernet C3_Ethernet C4_Ethernet C5_Ethernet C6_Ethernet C7_Ethernet C8_Ethernet C9_Ethernet C10_Ethernet R1_Ethernet R2_Ethernet R3_Ethernet R4_Ethernet R5_Ethernet R6_Ethernet R7_Ethernet R8_Ethernet R9_Ethernet R10_Ethernet U1_Ethernet Y1_Ethernet

### Ports
GPIO6 (in), GPIO7 (out), GPIO21 (in), GPIO36 (in), GPIO37 (in), GPIO38 (out)

### Nets
3V3: C6_Ethernet.2 C7_Ethernet.2 C8_Ethernet.2 C9_Ethernet.2 C10_Ethernet.2 C11_Ethernet.2 J1_Ethernet.4(TCT) J1_Ethernet.5(RCT) J1_Ethernet.10 J1_Ethernet.12 R1_Ethernet.2 R2_Ethernet.2 R4_Ethernet.1 R5_Ethernet.1 R6_Ethernet.1 R7_Ethernet.2 R8_Ethernet.1 R9_Ethernet.1 R10_Ethernet.2 U1_Ethernet.4(AVDD) U1_Ethernet.8(AVDD) U1_Ethernet.11(AVDD) U1_Ethernet.15(AVDD) U1_Ethernet.17(AVDD) U1_Ethernet.21(AVDD) U1_Ethernet.28(VDD)  [also labelled AVDD]
GND: C1_Ethernet.2 C2_Ethernet.1 C3_Ethernet.2 C4_Ethernet.2 C5_Ethernet.1 C6_Ethernet.1 C7_Ethernet.1 C8_Ethernet.1 C9_Ethernet.1 C10_Ethernet.1 C11_Ethernet.1 J1_Ethernet.8(CHS_GROUND) J1_Ethernet.S1 J1_Ethernet.S2 R3_Ethernet.2 U1_Ethernet.3(AGND) U1_Ethernet.9(AGND) U1_Ethernet.14(AGND) U1_Ethernet.16(AGND) U1_Ethernet.19(AGND) U1_Ethernet.29(GND) U1_Ethernet.48(AGND) Y1_Ethernet.2(GND&Lid) Y1_Ethernet.4(GND&Lid)
ACTLED: R12_Ethernet.2 U1_Ethernet.27(ACTLED)
LINKLED: R11_Ethernet.2 U1_Ethernet.25(LINKLED)
RX_N: J1_Ethernet.6(RD-) R10_Ethernet.1 U1_Ethernet.5(RXN)
RX_P: J1_Ethernet.3(RD+) R9_Ethernet.2 U1_Ethernet.6(RXP)
TX_N: J1_Ethernet.2(TD-) R8_Ethernet.2 U1_Ethernet.1(TXN)
TX_P: J1_Ethernet.1(TD+) R7_Ethernet.1 U1_Ethernet.2(TXP)
NetC1_Ethernet_1: C1_Ethernet.1 U1_Ethernet.30(XI/CLKIN) Y1_Ethernet.1(Crystal)
NetC2_Ethernet_2: C2_Ethernet.2 U1_Ethernet.31(XO) Y1_Ethernet.3(Crystal)
NetC3_Ethernet_1: C3_Ethernet.1 U1_Ethernet.18(VBG)
NetC4_Ethernet_1: C4_Ethernet.1 U1_Ethernet.20(TOCAP)
NetC5_Ethernet_2: C5_Ethernet.2 U1_Ethernet.22(1V2O)
NetESP32S3_11: R1_Ethernet.1 U1_Ethernet.37(~{RST}) ; port GPIO6
NetESP32S3_12: R2_Ethernet.1 U1_Ethernet.36(~{INT}) ; port GPIO7
NetESP32S3_27: U1_Ethernet.32(~{SCS}) ; port GPIO21
NetESP32S3_41: U1_Ethernet.33(SCLK) ; port GPIO36
NetESP32S3_42: U1_Ethernet.35(MOSI) ; port GPIO37
NetESP32S3_43: U1_Ethernet.34(MISO) ; port GPIO38
NetJ1_Ethernet_9: J1_Ethernet.9 R11_Ethernet.1
NetJ1_Ethernet_11: J1_Ethernet.11 R12_Ethernet.1
NetR3_Ethernet_1: R3_Ethernet.1 U1_Ethernet.10(EXRES1)
NetR4_Ethernet_2: R4_Ethernet.2 U1_Ethernet.45(PMODE0)
NetR5_Ethernet_2: R5_Ethernet.2 U1_Ethernet.44(PMODE1)
NetR6_Ethernet_2: R6_Ethernet.2 U1_Ethernet.43(PMODE2)

Not connected (* = marked no-connect by the designer): J1_Ethernet 7(NC); U1_Ethernet 7(DNC)* 12(NC)* 13(NC)* 23(RSVD) 24(SPDLED) 26(DUPLED) 38(RSVD) 39(RSVD) 40(RSVD) 41(RSVD) 42(RSVD) 46(NC)* 47(NC)*

### Layout directives
differential pair: RX_N, RX_P, TX_N, TX_P

### Notes on the sheet
- (in symbol CMP-2000-05321-1) GND

### Library data of the parts
C1_Ethernet C2_Ethernet = CMP-2000-06334-1: Chip Capacitor, 18 pF, +/- 5%, 50 V, -55 to 125 degC, 0603 (1608 Metric), RoHS, Tape and Reel; Manufacturer: Murata; Capacitance: 18pF; Voltage - Rated: 50V; Online Catalog: GRMSeries; Temperature Coefficient: C0G,NP0; Other Names: 490-1409-2GRM39C0G180J050AD; Package / Case: 0603(1608Metric); Package Reference: 0603; Height - Seated (Max): -; Package Description: 2-Pin Surface Mount Device, Body 1.6 x 0.8 mm; Category: Capacitors; Applications: GeneralPurpose; Size / Dimension: 0.063"Lx0.031"W(1.60mmx0.80mm); Mounting Type: SurfaceMount,MLCC; Family: CeramicCapacitors; Packaging: Tape&Reel(TR); Tolerance: ±5%; Ratings: -; Operating Temperature: -55°C~125°C; Datasheet URL: http://search.murata.co.jp/Ceramy/image/img/A01X/G101/ENG/GRM1885C1H180JA01-01.pdf; Standard Package: 4,000; Lead Style: -; Thickness (Max): 0.035"(0.90mm); Manufacturer URL: http://www.murata.com/; Mounting Technology: SurfaceMount; Lead Spacing: -; Series: GRM; Features: -; Datasheet Version: 03/2016
C3_Ethernet C4_Ethernet C5_Ethernet C6_Ethernet C7_Ethernet C8_Ethernet C9_Ethernet C11_Ethernet = CMP-001-00061-3: Chip Capacitor, 100nF +/-20%, 10V, 0402, Thickness 0.6 mm; Tolerance: 20%; Mounting Technology: SMT; Voltage Rating: 10V; Max Operating Temperature: 85°C; Pins: 2; Case/Package: 0402; Min Operating Temperature: -55°C
C10_Ethernet = CMP-001-00075-4: Chip Capacitor, 10µF +/-20%, 10V, 0603, Thickness 1 mm; Tolerance: 10%; Voltage Rating: 10V; Max Operating Temperature: 85°C; Pins: 2; Case/Package: 0603; Mounting Technology: SMT; Min Operating Temperature: -55°C
J1_Ethernet = CMP-2000-05321-1: 10/100 Base-TX RJ45 1 x 1 Tab-Down with LEDs Integrated Magnetics Connector, 0 to 70 degC, 12-Pin THD, RoHS, Tube; Manufacturer: Pulse; Body Orientation: RightAngle; Number of Contacts: 8; Gender: F; Pitch: 2.54mm; Category: ConnectorTelephoneandTelecom; Package Description: 12-Pin Through Hole Device, Body 16.26 x 21.59 mm, Pitch 1.27 mm; Datasheet Version: Rev. D, 05/2006; Termination Method: Solder; Type: RJ-45; Package Reference: J0011D21BNL; Manufacturer URL: http://www.pulseelectronics.com/; Mounting: ThroughHole; Datasheet URL: http://datasheet.octopart.com/J0011D21BNL-Pulse-datasheet-120436.pdf
R1_Ethernet R2_Ethernet R4_Ethernet R5_Ethernet R6_Ethernet = CMP-009-00179-1: Res Thick Film 1206 10K Ohm 1% 0.25W(1/4W) ±100ppm/C Pad SMD Automotive T/R; Manufacturer Lifecycle Status: ACTIVE; Operating Supply Voltage: 200V; Temperature Coefficient: 100ppm/°C; Power Rating: 250mW; Case/Package: 1206; Export Control Classification Number (ECCN) Code: EAR99; REACH SVHC: Yes; Mounting Technology: Surface Mount; Voltage Rating (DC): 200V; Ambient Temperature Range High: 70°C; Introduction Date: 2018-03-13; Min Operating Temperature: -55°C; Width: 1.55mm; Packaging: Cut Tape; Voltage Rating: 200V; Ratings: AEC-Q200; Max Operating Temperature: 155°C; Number of Terminals: 2; Composition: Thick Film; Lifecycle Status: Production; Schedule B: 8533210025, 8533210025; China RoHS: Non-Compliant; Harmonized Tariff Schedule (HTS) Code: 8533.21.00.30; Length: 3.1mm; Working Voltage: 200V; Tolerance: 1%; RoHS: Compliant; Height: 550µm
R3_Ethernet = CMP-250906-053812-1: RES Thin Film,  12.4kΩ, 0.1%, 0.1W, 25ppm/°C, 0805; RoHS Compliant: Yes
R7_Ethernet R8_Ethernet R9_Ethernet R10_Ethernet = CMP-1659-00036-1: General Purpose Chip Resistor, 49.9 Ohm, +/- 1%, -55 to 155 degC, 0603 (1608 Metric), RoHS, Tape and Reel; Max Supply Voltage: 3.63 V; Case\Package: LQFP; Interface: SPI; Min Supply Voltage: 2.97 V; PackageReference: 0603; Packaging: Tray; ComponentLink2Description: Datasheet; ComponentLink1Description: Manufacturer URL; ComponentLink2URL: https://datasheet.ciiva.com/11808/0900766b80f96399-11808223.pdf; RoHSCompliant: true; Max Operating Temperature: 85 degC; ComponentLink1URL: http://www.yageo.com/; PackageDescription: 2-Pin Surface Mount Device, Body 1.6 x 0.8 mm; DatasheetVersion: Rev. 4, 04/2009; Min Operating Temperature: -40 degC; Package Quantity: 250; Pins: 48
R11_Ethernet R12_Ethernet = CMP-009-00132-3: Chip Resistor, 330 Ohms, +/-5 %, 63 mW, -55 to 155 degC, 0402; Power: 63mW; Tolerance: 5%; Pins: 2; Max Operating Temperature: 155°C; Min Operating Temperature: -55°C; Case/Package: 0402
U1_Ethernet = CMP-020-00020-3: Hardwired TCP/IP Embedded Ethernet Controller, 3.3 V, 25 MHz, -40 to 85 degC, 48-Pin LQFP, RoHS, Tray; Manufacturer: WIZnet; Interface: SPI; Min Supply Voltage: 2.97V; Max Supply Voltage: 3.63V; Package Quantity: 250; Package Description: 48-Pin Low-profile Quad Flat Package, Body 7.00 x 7.00 mm, Pitch 0.50 mm; Package Reference: LQFP-48; Case/Package: LQFP; RoHS Compliant: True; Mounting Technology: SM; Datasheet URL: http://wizwiki.net/wiki/lib/exe/fetch.php?media=products:w5500:w5500_ds_v106e_141230.pdf; Manufacturer URL: http://www.wiznet.co.kr/; Packaging: Tray; Min Operating Temperature: -40°C; Pins: 48; Datasheet Version: Rev. 1.0.6, 12/2014; Max Operating Temperature: 85°C
Y1_Ethernet = CMP-03913-116876467-2: WE-XTAL Quartz Crystal; Frequency: 25MHz; Max Operating Temperature: 85°C; Width: 2.5mm; Height: 800µm; Length: 3.2mm; Min Operating Temperature: -40°C

## Sheet Power Regulator.SchDoc
size 165 x 114 mm
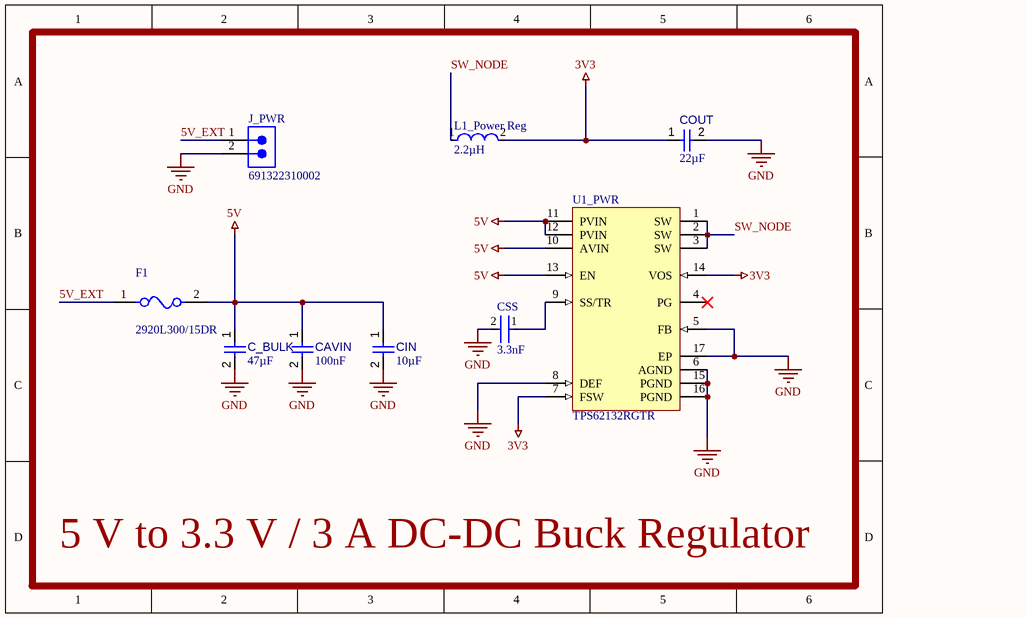
[diagram p5: Power Regulator.SchDoc]

### Parts
C_BULK  value 47µF  [CAPC0805(2012)145_L]  (hidden comment: Capacitor 47µF +/-40% 6.3V 0805)
CAVIN  value 100nF  [CAPC1608X90X40NL10T20]  (hidden comment: Capacitor 100 nF +/-10% 50 V 0603)
CIN  value 10µF  [CAPC2013X135X45NL10T25]  (hidden comment: Capacitor 10 uF +/- 10% 16 V 0805)
COUT  value 22µF  [CAPC0805(2012)145_L]  (hidden comment: Capacitor 22µF +/-40% 16V 0805)
CSS  value 3.3nF  [FP-GCG155-0_1-IPC_A]  (hidden comment: GCG155R71H332KA01D)
F1  2920L300/15DR  [FP-2920L-MFG]
J_PWR  691322310002  [691322310002]
L1_Power_Reg  value 2.2µH  [FP-XFL4020-MFG]  (hidden comment: XFL4020-222MEB)
U1_PWR  TPS62132RGTR  [RGT0016C_V]

### Nets
3V3: COUT.1 L1_Power_Reg.2 U1_PWR.7(FSW) U1_PWR.14(VOS)
5V: C_BULK.1 CAVIN.1 CIN.1 F1.2 U1_PWR.10(AVIN) U1_PWR.11(PVIN) U1_PWR.12(PVIN) U1_PWR.13(EN)
GND: C_BULK.2 CAVIN.2 CIN.2 COUT.2 CSS.2 J_PWR.2 U1_PWR.5(FB) U1_PWR.6(AGND) U1_PWR.8(DEF) U1_PWR.15(PGND) U1_PWR.16(PGND) U1_PWR.17(EP)
5V_EXT: F1.1 J_PWR.1
SW_NODE: L1_Power_Reg.1 U1_PWR.1(SW) U1_PWR.2(SW) U1_PWR.3(SW)
NetCSS_1: CSS.1 U1_PWR.9(SS/TR)

Not connected (* = marked no-connect by the designer): U1_PWR 4(PG)*

### Notes on the sheet
- 5 V to 3.3 V / 3 A DC-DC Buck Regulator

### Library data of the parts
C_BULK = CMP-001-00082-4: Chip Capacitor, 47µF +/-40%, 6.3V, 0805, Thickness 1.45 mm; Tolerance: 10%; Min Operating Temperature: -55°C; Max Operating Temperature: 85°C; Case/Package: 0805; Pins: 2; Mounting Technology: SMT; Voltage Rating: 6.3V
CAVIN = CMP-001-00017-6: Chip Capacitor, 100 nF, +/- 10%, 50 V, 0603 (1608 Metric); Voltage Rating: 50V; Capacitor Type: Ceramic; Tolerance: 10%; Mounting Technology: SM; Max Operating Temperature: 125°C; RoHS Compliant: True; Pins: 2; Case/Package: 0603; Min Operating Temperature: -55°C
CIN = CMP-001-00015-6: Chip Capacitor, 10 uF, +/- 10%, 16 V, 0805 (2012 Metric); Voltage Rating: 16V; Capacitor Type: Ceramic; RoHS Compliant: True; Max Operating Temperature: 85°C; Min Operating Temperature: -55°C; Mounting Technology: SM; Tolerance: 10%; Case/Package: 0805; Pins: 2
COUT = CMP-001-00081-4: Chip Capacitor, 22µF +/-40%, 16V, 0805, Thickness 1.45 mm; Tolerance: 5%; Voltage Rating: 16V; Mounting Technology: SMT; Pins: 2; Max Operating Temperature: 85°C; Case/Package: 0805; Min Operating Temperature: -55°C
CSS = CMP-001-00086-1: Ceramic Capacitor, YES, Ceramic, 50V, 10% +Tol, 10% -Tol, X7R, 15% TC, 0.0033uF, Surface Mount, 1005M/0402; Manufacturer Lifecycle Status: IN PRODUCTION; Case/Package: 0402; Voltage Rating: 50V; Number of Terminals: 2; RoHS: Compliant; Harmonized Tariff Schedule (HTS) Code: 8532.24.00.20; REACH SVHC: Yes; Width: 500µm; Material: Ceramic; Mounting Technology: Surface Mount; Max Operating Temperature: 125°C; Lifecycle Status: Production; Dielectric: X7R; Voltage Rating (DC): 50V; Export Control Classification Number (ECCN) Code: EAR99; Min Operating Temperature: -55°C; Ratings: AEC-Q200; Length: 1mm; Introduction Date: 2013-11-20; Height: 500µm; Dielectric Material: Ceramic; Thickness: 500µm
F1 = CMP-005-00013-1: PTC fuse, self-resetting, SMD 2920, 15 V (DC), 40 A, 5 A (trip), 3 A (hold), 2920L300/15DR; Power Dissipation: 1.5W; Max Current Rating: 40A; Operating Supply Voltage: 15V; Approvals: TUV, cULus; Time to Trip: 20s; Trip Current: 5A; Ratings: TUV; Hold Current: 3A; Minimum Resistance Initial (Rmin): 15mΩ; Value: 15mΩ; Maximum Resistance 1 Hour (R1max): 48mΩ; Termination: SMD/SMT; Case/Package: 2920; Harmonized Tariff Schedule (HTS) Code: 8533.40.80.70; Mounting Technology: Surface Mount; Width: 5.44mm; Min Operating Temperature: -40°C; China RoHS: Compliant; REACH SVHC: Yes; Ambient Temperature Range High: 85°C; Case Code (Imperial): 2920; Number of Terminals: 2; Length: 7.98mm; Lead Free: Lead Free; Introduction Date: 2006-06-15; Working Voltage: 15V; Height: 1.25mm; Voltage Rating (DC): 15V; Max Operating Temperature: 85°C; Lifecycle Status: Production; Current Rating: 40A; Export Control Classification Number (ECCN) Code: EAR99; RoHS: Compliant; Voltage Rating: 15V; Max Voltage Rating (DC): 15V; Case Code (Metric): 7351
J_PWR = CMP-002-00077-1: Terminal Block, Header, 2Ways, Th R/A;; Manufacturer Lifecycle Status: ACTIVE; Current: 10A; Number of Levels: 1; YEOL: 1 = Estimated lifetime > 10 years; Voltage: 300V; Number of Contacts: 2; Gender: Male; Pitch: 3.81mm; RoHS: Compliant; Termination: Solder; Pins: 2; Lead Pitch: 3.81mm; Packaging: Box; Contact Plating: Tin; Number of Rows: 1; Voltage Rating: 300V; Current Rating: 10A; Lifecycle Status: Production; Min Operating Temperature: -40°C; Length: 8.81mm; Contact Material: Tin; Width: 9.01mm; Number of Positions Per Level: 2; Mounting Technology: Through Hole; Color: Green; Height: 7.2mm; Max Operating Temperature: 105°C
L1_Power_Reg = CMP-006-00022-1: General Purpose Inductor, 2.2uH, 20%, 1 Element, Composite-Core, SMD, 1616; ESR: 23.5mΩ; RMS Current (Irms): 8A; Self Resonant Frequency: 38MHz; Shielding: Shielded; Test Frequency: 1MHz; Number of Circuits: 1; Saturation Current: 3.1A; REACH SVHC: Yes; Ambient Temperature Range High: 125°C; RoHS: Compliant; Height: 2.1mm; DC Resistance (DCR): 23.5mΩ; Max DC Current: 8A; Max Current Rating: 8A; Width: 4mm; Ratings: AEC-Q200; Tolerance: 20%; Core Material: Composite; Case/Package: 1616; Max Operating Temperature: 125°C; Min Operating Temperature: -40°C; Termination: SMD/SMT; Lead Free: Contains Lead; Length: 4mm; Lifecycle Status: Obsolete; Number of Terminals: 2
U1_PWR = CMP-011-00013-1: 3-17V 3A Step-Down Converter in 3x3 QFN Package 16-VQFN -40 to 125; Manufacturer Lifecycle Status: ACTIVE; Number of Outputs: 1; Output Voltage: 3.3V; Max Supply Voltage: 17V; Quiescent Current: 17µA; Synchronous Rectifier: Yes; Output Configuration: Positive; Min Input Voltage: 3V; Output Type: Fixed; Switching Frequency: 2.5MHz; Topology: Buck; Lifecycle Status: Production; Min Operating Temperature: -40°C; Case/Package: VQFN; Max Output Voltage: 3.3V; Output Current: 3A; RoHS: Compliant; Height: 1mm; Min Output Voltage: 3.3V; Max Output current: 3A; Thickness: 900µm; Max Operating Temperature: 125°C; Schedule B: 8542390000, 8542390000; Lead Free: Lead Free; Length: 3mm; Operating Supply Voltage: 17V; Pins: 16; Width: 3mm